# EasyEDA Pro project ProPrj_Hitboard Zero PCB_2026-02-22.epro

# Board PCB1
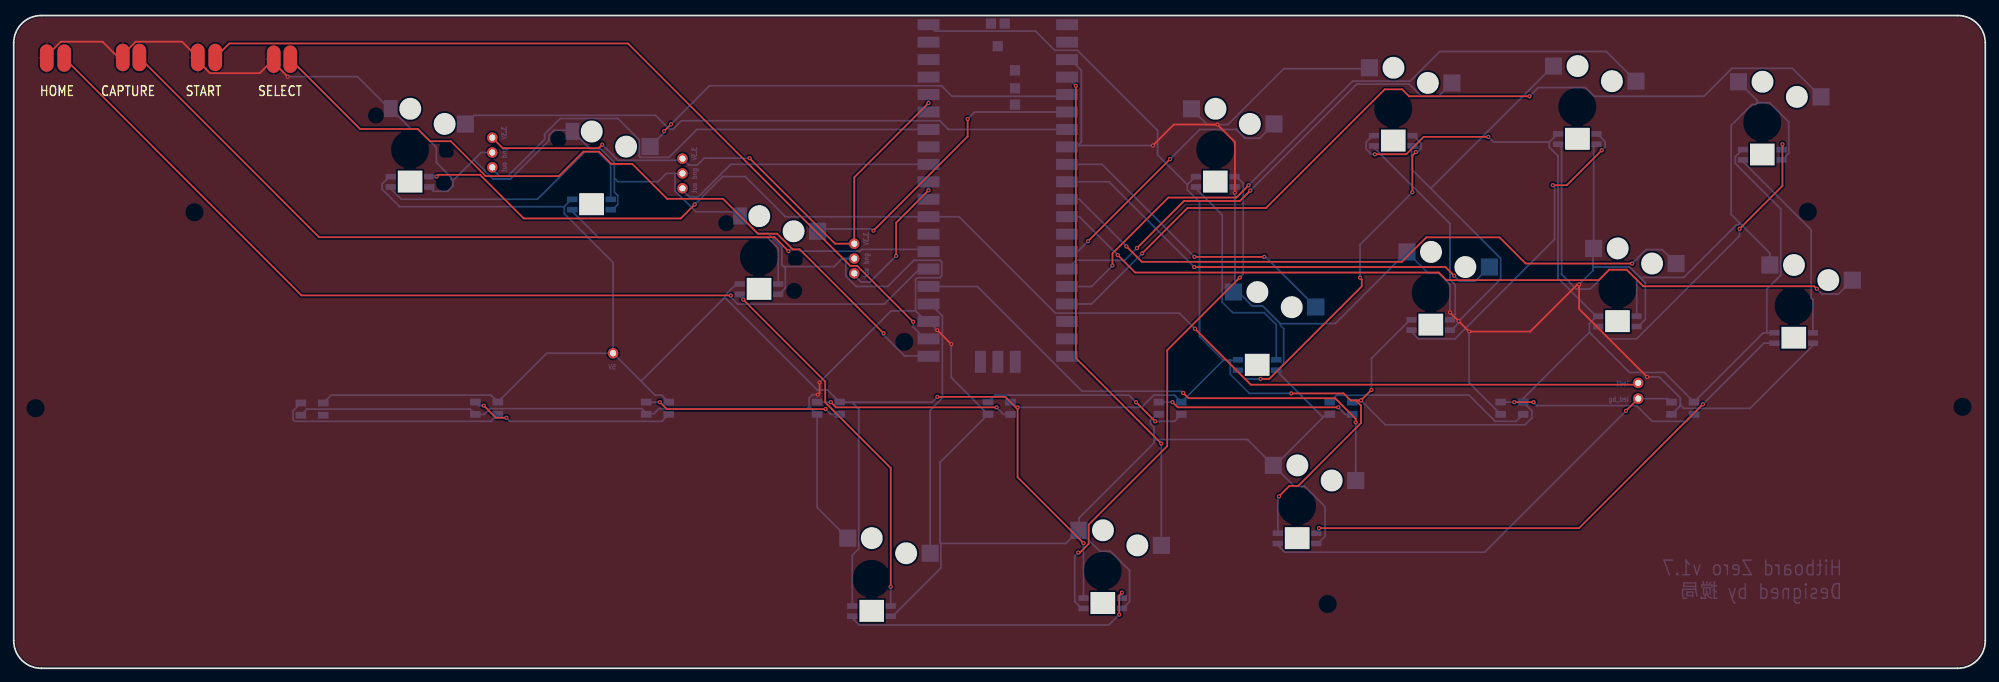
[diagram p0: board, top side]
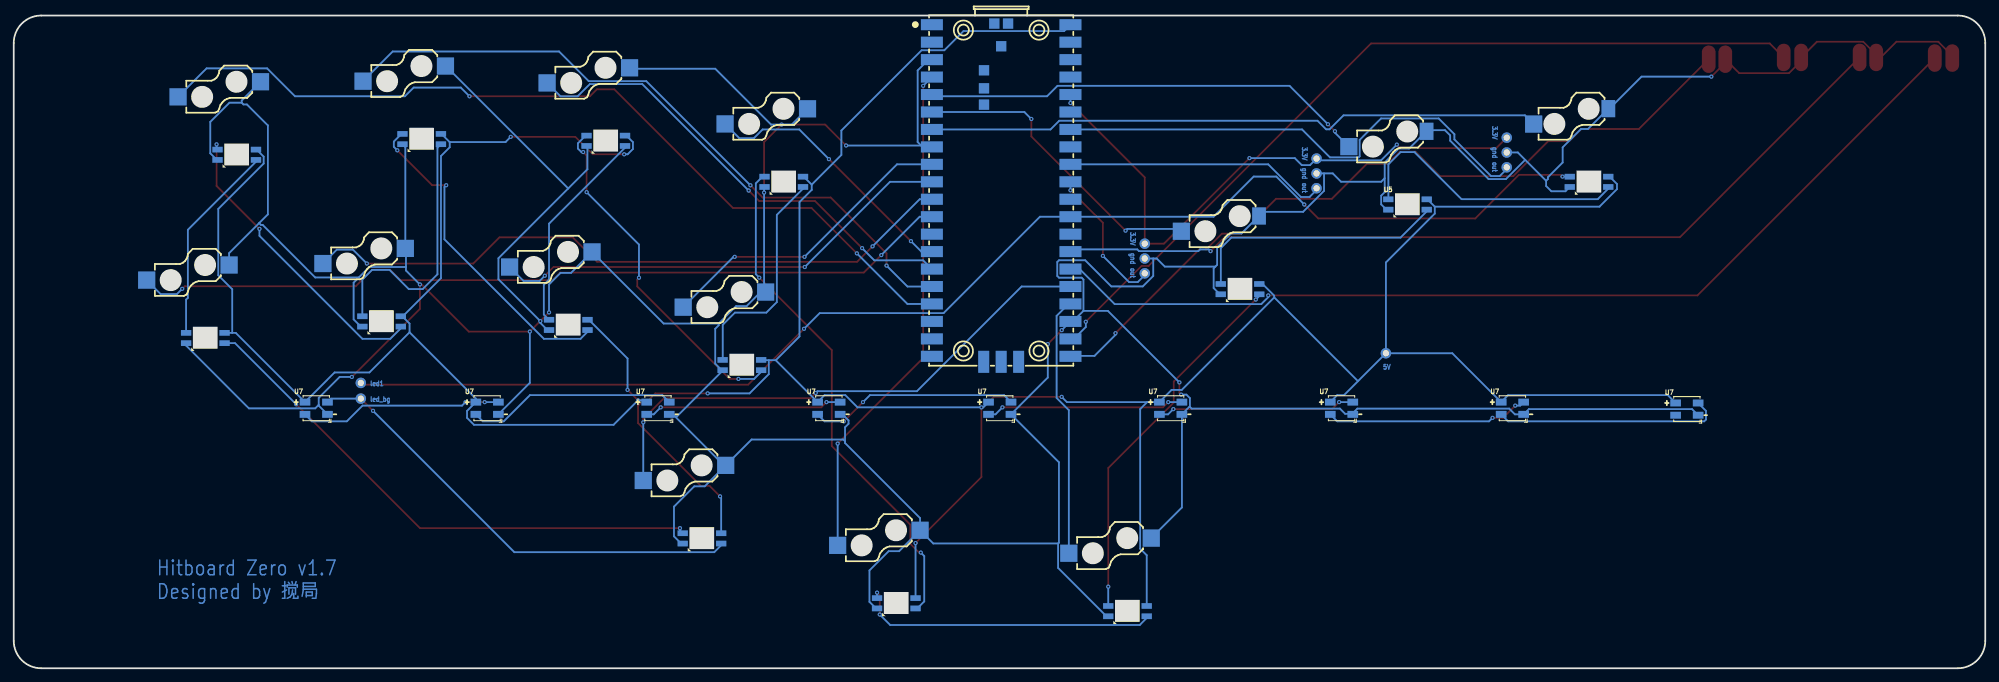
[diagram p1: board, bottom side, seen from below]

Outline 287 x 95 mm; copper layers: Top Layer, Bottom Layer. Coordinates in mm from the lower left corner of the outline.
Outline path: 0,91 arc(1.17,93.83) 4,95 283,95 arc(285.83,93.83) 287,91 287,4 arc(285.83,1.17) 283,0 4,0 arc(1.17,1.17) 0,4 0,91
Stack: Top Layer 0.035mm / Dielectric1 1.51mm FR4 er 4.5 / Bottom Layer 0.035mm

## Design rules (mm)
template: JLCPCB Capability(Two Layers Board)
spacing copperThickness1oz (default): track to track 0.102, other pairs 0.152 to 0.3
spacing copperThickness2oz: track to track 0.203, other pairs 0.152 to 0.3
track width copperThickness1oz (default): min 0.127, default 0.254, max 2.54
track width copperThickness2oz: min 0.203, default 0.254, max 2.54
differential pair differentialPair (default): width min 0.127, default 0.254, max 2.54; gap min 0.152, default 0.152
via viaSize (default): diameter min 0.5, default 0.61, max 10; hole min 0.3, default 0.305, max 6.3

## Placement (name value [footprint] x y rotation side)
NOREF  -  [Pad_e675]  4.81 88.81 0 top
NOREF#2  -  [Pad_e678]  18.29 88.9 0 top
NOREF#3  -  [Pad_e676]  7.35 88.81 0 top
NOREF#4  -  [Pad_e10672]  69.66 72.91 90 top
NOREF#5  -  [Pad_e680]  29.34 88.9 0 top
NOREF#6  -  [Pad_e677]  15.87 88.9 0 top
NOREF#7  -  [Pad_e10656]  122.35 61.8 90 top
NOREF#8  -  [Pad_e10666]  97.35 69.86 90 top
NOREF#9  -  [Pad_e5255]  236.47 39.24 0 top
NOREF#10  -  [Pad_e434]  236.47 41.53 0 top
NOREF#11  -  [Pad_e10670]  69.66 77.23 90 top
NOREF#12  -  [Pad_e10657]  122.35 59.64 90 top
NOREF#13  -  [Pad_e681]  37.85 88.65 0 top
NOREF#14  -  [Pad_e10658]  122.35 57.48 90 top
NOREF#15  -  [Pad_e10664]  97.35 74.18 90 top
NOREF#16  -  [Pad_e10671]  69.66 75.07 90 top
NOREF#17  -  [Pad_e682]  40.26 88.65 0 top
NOREF#18  -  [Pad_e679]  26.8 88.9 0 top
NOREF#19  -  [Pad_e10654]  87.25 45.85 0 top
NOREF#20  -  [Pad_e10665]  97.35 72.02 90 top
U1  PICO  [COMM-SMD_L51.0-W21.0-P2.54_SC0916]  143.26 69.22 270 bottom
U5  -  [LED-SMD_L3.2-W2.8_YO-WS2812B-3528]  186.82 18.9 180 bottom
U5#2  -  [LED-SMD_L3.2-W2.8_YO-WS2812B-3528]  57.69 70.8 180 bottom
U5#3  -  [LED-SMD_L3.2-W2.8_YO-WS2812B-3528]  84.1 67.5 180 bottom
U5#4  -  [LED-SMD_L3.2-W2.8_YO-WS2812B-3528]  108.49 55.18 180 bottom
U5#5  -  [LED-SMD_L3.2-W2.8_YO-WS2812B-3528]  124.87 8.31 180 bottom
U5#6  -  [LED-SMD_L3.2-W2.8_YO-WS2812B-3528]  158.52 9.46 180 bottom
U5#7  -  [LED-SMD_L3.2-W2.8_YO-WS2812B-3528]  174.91 70.8 180 bottom
U5#8  -  [LED-SMD_L3.2-W2.8_YO-WS2812B-3528]  181 44.13 180 bottom
U5#9  -  [LED-SMD_L3.2-W2.8_YO-WS2812B-3528]  200.81 76.77 180 bottom
U5#10  -  [LED-SMD_L3.2-W2.8_YO-WS2812B-3528]  206.28 49.97 180 bottom
U5#11  -  [LED-SMD_L3.2-W2.8_YO-WS2812B-3528]  227.61 77.02 180 bottom
U5#12  -  [LED-SMD_L3.2-W2.8_YO-WS2812B-3528]  233.45 50.48 180 bottom
U5#13  -  [LED-SMD_L3.2-W2.8_YO-WS2812B-3528]  254.54 74.74 180 bottom
U5#14  -  [LED-SMD_L3.2-W2.8_YO-WS2812B-3528]  259.11 48.07 180 bottom
U6  -  [CONN-SMD_HOTPLUGPAKAGE__C9900010116-1]  235.99 60 180 bottom
U6#2  -  [CONN-SMD_HOTPLUGPAKAGE__C9900010116-1]  189.36 28.43 180 bottom
U6#3  -  [CONN-SMD_HOTPLUGPAKAGE__C9900010116-1]  127.41 17.84 180 bottom
U6#4  -  [CONN-SMD_HOTPLUGPAKAGE__C9900010116-1]  161.06 18.98 180 bottom
U6#5  -  [CONN-SMD_HOTPLUGPAKAGE__C9900010116-1]  177.45 80.32 180 bottom
U6#6  -  [CONN-SMD_HOTPLUGPAKAGE__C9900010116-1]  183.54 53.65 180 bottom
U6#7  -  [CONN-SMD_HOTPLUGPAKAGE__C9900010116-1]  203.35 86.29 180 bottom
U6#8  -  [CONN-SMD_HOTPLUGPAKAGE__C9900010116-1]  208.82 59.5 180 bottom
U6#9  -  [CONN-SMD_HOTPLUGPAKAGE__C9900010116-1]  230.15 86.55 180 bottom
U6#10  -  [CONN-SMD_HOTPLUGPAKAGE__C9900010116-1]  257.08 84.26 180 bottom
U6#11  -  [CONN-SMD_HOTPLUGPAKAGE__C9900010116-1]  261.65 57.59 180 bottom
U6#12  -  [CONN-SMD_HOTPLUGPAKAGE__C9900010116-1#2]  60.23 80.32 180 bottom
U6#13  -  [CONN-SMD_HOTPLUGPAKAGE__C9900010116-1#3]  86.64 77.02 180 bottom
U6#14  -  [CONN-SMD_HOTPLUGPAKAGE__C9900010116-1#3]  111.03 64.7 180 bottom
U7  -  [LED-SMD_4P-L3.5-W3.5-TL_WS2812B]  43.43 37.72 180 bottom
U7#2  -  [LED-SMD_4P-L3.5-W3.5-TL_WS2812B]  242.97 37.85 180 bottom
U7#3  -  [LED-SMD_4P-L3.5-W3.5-TL_WS2812B]  218.09 37.85 180 bottom
U7#4  -  [LED-SMD_4P-L3.5-W3.5-TL_WS2812B]  193.21 37.85 180 bottom
U7#5  -  [LED-SMD_4P-L3.5-W3.5-TL_WS2812B]  168.34 37.85 180 bottom
U7#6  -  [LED-SMD_4P-L3.5-W3.5-TL_WS2812B]  143.46 37.85 180 bottom
U7#7  -  [LED-SMD_4P-L3.5-W3.5-TL_WS2812B]  118.59 37.85 180 bottom
U7#8  -  [LED-SMD_4P-L3.5-W3.5-TL_WS2812B]  93.71 37.85 180 bottom
U7#9  -  [LED-SMD_4P-L3.5-W3.5-TL_WS2812B]  68.83 37.85 180 bottom

## Footprints (pads in the part's own frame, mm; a bottom-side part is the same pattern mirrored in y, then rotated)
COMM-SMD_L51.0-W21.0-P2.54_SC0916
  rect 1.6x3.2 smd: 1(-24.445,-10.088) 2(-21.905,-10.088) 3(-19.365,-10.088) 4(-16.825,-10.088) 5(-14.285,-10.088) 6(-11.745,-10.088) 7(-9.205,-10.088) 8(-6.665,-10.088) 9(-4.125,-10.088) 10(-1.585,-10.088) 11(0.955,-10.088) 12(3.495,-10.088) 13(6.035,-10.088) 14(8.575,-10.088) 15(11.115,-10.088) 16(13.655,-10.088) 17(16.195,-10.088) 18(18.735,-10.088) 19(21.275,-10.088) 20(23.815,-10.088) 21(23.815,10.088) 22(21.275,10.088) 23(18.735,10.088) 24(16.195,10.088) 25(13.655,10.088) 26(11.115,10.088) 27(8.575,10.088) 28(6.035,10.088) 29(3.495,10.088) 30(0.955,10.088) 31(-1.585,10.088) 32(-4.125,10.088) 33(-6.665,10.088) 34(-9.205,10.088) 35(-11.745,10.088) 36(-14.285,10.088) 37(-16.825,10.088) 38(-19.365,10.088) 39(-21.905,10.088) 40(-24.445,10.088)
  rect 3.2x1.6 smd: 41(24.615,-2.54) 42(24.615,0) 43(24.615,2.54)
  rect 1.5x1.5 smd: TP1(-21.315,0) TP2(-24.615,1) TP3(-24.615,-1) TP4(-17.815,-2.5) TP5(-15.188,-2.5) TP6(-12.815,-2.5)
CONN-SMD_HOTPLUGPAKAGE__C9900010116-1
  rect 2.5x2.5 smd: 1(-6,-1.1) 2(6,1.1)
CONN-SMD_HOTPLUGPAKAGE__C9900010116-1#2
  rect 2.5x2.5 smd: 1(-5.515,-1.12)
  rect 2x2.5 smd: 2(5.36,1.125)
CONN-SMD_HOTPLUGPAKAGE__C9900010116-1#3
  rect 2.5x2.5 smd: 1(-6,-1.1)
  rect 2x2.5 smd: 2(5.31,1.125)
LED-SMD_4P-L3.5-W3.5-TL_WS2812B
  rect 1.545x0.997 smd: 1(-1.637,0.89) 2(-1.637,-0.89) 3(1.637,-0.89) 4(1.637,0.89)
LED-SMD_L3.2-W2.8_YO-WS2812B-3528
  rect 1.5x0.82 smd: 1(2.8,0.75) 2(2.8,-0.75) 3(-2.8,-0.75) 4(-2.8,0.75)
Pad_e434
  round 1.524 hole 0.914: 1(0,0)
Pad_e675
  oval 2x4 smd: 1(0,0)
Pad_e676
  oval 2x4 smd: 1(0,0)
Pad_e677
  oval 2x4 smd: 1(0,0)
Pad_e678
  oval 2x4 smd: 1(0,0)
Pad_e679
  oval 2x4 smd: 1(0,0)
Pad_e680
  oval 2x4 smd: 1(0,0)
Pad_e681
  oval 2x4 smd: 1(0,0)
Pad_e682
  oval 2x4 smd: 1(0,0)
Pad_e5255
  round 1.524 hole 0.914: 1(0,0)
Pad_e10654
  round 1.524 hole 0.914: 1(0,0)
Pad_e10656
  round 1.524 hole 0.914: 1(0,0)
Pad_e10657
  round 1.524 hole 0.914: 1(0,0)
Pad_e10658
  round 1.524 hole 0.914: 1(0,0)
Pad_e10664
  round 1.524 hole 0.914: 1(0,0)
Pad_e10665
  round 1.524 hole 0.914: 1(0,0)
Pad_e10666
  round 1.524 hole 0.914: 1(0,0)
Pad_e10670
  round 1.524 hole 0.914: 1(0,0)
Pad_e10671
  round 1.524 hole 0.914: 1(0,0)
Pad_e10672
  round 1.524 hole 0.914: 1(0,0)

## Nets
3V3: NOREF#7.1 NOREF#11.1 NOREF#15.1 U1.36
GND: NOREF.1 NOREF#6.1 NOREF#12.1 NOREF#13.1 NOREF#16.1 NOREF#18.1 NOREF#20.1 U1.3 U1.8 U1.23 U5.3 U5#2.3 U5#3.3 U5#4.3 U5#5.3 U5#6.3 U5#7.3 U5#8.3 U5#9.3 U5#10.3 U5#11.3 U5#12.3 U5#13.3 U5#14.3 U6.2 U6#2.2 U6#3.2 U6#4.2 U6#5.2 U6#6.2 U6#7.2 U6#8.2 U6#9.2 U6#10.2 U6#11.2 U6#12.2 U6#13.2 U6#14.2 U7.3 U7#2.3 U7#3.3 U7#4.3 U7#5.3 U7#6.3 U7#7.3 U7#8.3 U7#9.3
VCC: NOREF#19.1 U1.40 U5.1 U5#2.1 U5#3.1 U5#4.1 U5#5.1 U5#6.1 U5#7.1 U5#8.1 U5#9.1 U5#10.1 U5#11.1 U5#12.1 U5#13.1 U5#14.1 U7.1 U7#2.1 U7#3.1 U7#4.1 U7#5.1 U7#6.1 U7#7.1 U7#8.1 U7#9.1
2: U5#2.2 U5#3.4
3: U5#3.2 U5#4.4
4: U5#4.2 U5#5.4
5: U5#5.2 U5#6.4
6: U5#6.2 U5#7.4
7: U5#7.2 U5#8.4
8: U5#8.2 U5#9.4
9: U5#9.2 U5#10.4
10: U5#10.2 U5#11.4
11: U5#11.2 U5#12.4
12: U5#12.2 U5#13.4
13: U5#13.2 U5#14.4
14: U5.4 U5#14.2
15: NOREF#9.1 U5.2 U7#2.4
16: U7#2.2 U7#3.4
17: U7#3.2 U7#4.4
18: U7#4.2 U7#5.4
19: U7#5.2 U7#6.4
20: U7#6.2 U7#7.4
21: U7#7.2 U7#8.4
22: U7#8.2 U7#9.4
23: U7.4 U7#9.2
24: U7.2
A: U1.9 U6#6.1
B: U1.10 U6#8.1
CAPTURE: NOREF#2.1 U1.27
CIZHOU01: NOREF#4.1 U1.34
CIZHOU02: NOREF#8.1 U1.32
CIZHOU03: NOREF#14.1 U1.31
DOWN: U1.5 U6#13.1
HOME: NOREF#3.1 U1.26
L3: U1.24 U6#3.1
LB: U1.17 U6#10.1
LED1: NOREF#10.1 U1.29 U5#2.4
LEFT: U1.7 U6#12.1
LT: U1.12 U6#11.1
R3: U1.25 U6#2.1
RB: U1.16 U6#9.1
RIGHT: U1.6 U6#14.1
RT: U1.11 U6.1
SELECT: NOREF#17.1 U1.21
START: NOREF#5.1 U1.22
UP: U1.4 U6#4.1
X: U1.14 U6#5.1
Y: U1.15 U6#7.1

Pads without a net: U1 1 2 13 18 19 20 28 30 33 35 37 38 39 41 42 43 TP1 TP2 TP3 TP4 TP5 TP6

## Via types
v1: diameter 0.61, hole 0.305, Top Layer to Bottom Layer, 87 vias

## Routing (per net, layer and track width the routed paths; a pad name or vN(x,y) marks a point on that pad's centre or on a via; arc(x,y) is an arc through that point)
3V3: length 86.7
  Top Layer w0.254: v1(107.11,74.24) 119.56,61.8 NOREF#7.1 122.35,71.45 v1(133.17,82.26) ; NOREF#11.1 71.18,75.7 85.15,75.7 v1(85.66,76.21)
  Bottom Layer w0.254: v1(85.66,76.21) 87.95,73.92 97.09,73.92 NOREF#15.1 98.3,73.23 99.49,73.23 100.51,74.24 v1(107.11,74.24) ; v1(133.17,82.26) U1.36
GND: length 883.1
  Top Layer w0.254: NOREF.1 4.81,89.15 6.84,91.19 12.94,91.19 15.22,88.9 15.73,88.9 ; v1(177.77,69.22) 177.77,76.59 v1(175.23,79.13) 168.88,79.13 v1(165.83,76.08) ; v1(237.78,42.4) 227.87,52.3 v1(227.87,55.86) 227.62,55.86 220.76,49 v1(211.87,49) v1(210.35,50.53) v1(209.08,51.8) ; v1(117.31,41.6) 117.31,40.08 v1(117.06,39.82) ; 15.73,88.9 NOREF#6.1 ; 15.73,88.9 15.73,89.15 17.76,91.19 24.51,91.19 NOREF#18.1 26.8,88.39 28.57,86.61 35.81,86.61 NOREF#13.1 37.85,88.14 v1(39.88,86.11) ; v1(134.44,49.21) v1(136.47,47.18)
  Bottom Layer w0.254: 183.36,29.53 186.41,26.48 187.93,26.48 190.89,23.52 190.89,19.2 189.84,18.15 U5.3 ; 183.36,29.53 183.61,29.53 190.72,36.64 ; 183.36,29.53 179.59,33.29 166.24,33.29 165.99,33.04 ; U7#3.3 211.87,41.54 v1(211.87,49) ; 112.07,58.46 112.32,58.21 112.32,55.34 111.41,54.43 U5#4.3 ; 112.07,58.46 111.82,58.72 111.82,61.26 109.78,63.29 108.26,63.29 U6#14.2 105.12,66.43 99.3,66.43 96.25,69.48 96.25,72.02 ; 112.07,58.46 119.44,58.46 120.61,59.64 121.12,59.64 ; 255.65,58.69 255.65,60.42 251.28,64.79 ; 251.28,64.79 251.02,64.53 250.77,64.53 243.11,56.88 236.76,56.88 ; 251.28,64.79 250.01,66.06 250.01,79.01 253.05,82.06 253.56,82.06 253.82,82.31 ; 190.72,36.64 190.47,36.64 183.86,43.24 183.86,43.32 ; 190.72,36.64 191.04,36.96 U7#4.3 ; 121.12,59.64 121.12,57.1 122.64,55.57 127.22,55.57 131.03,59.38 134.84,59.38 135.09,59.13 135.09,57.1 134.84,56.84 131.53,56.84 131.28,56.59 131.28,52.02 ; 121.12,59.64 NOREF#12.1 ; 154.91,76.08 153.55,76.08 U1.8 ; 154.91,76.08 155.42,76.59 155.42,87 153.84,88.58 U1.3 ; 154.91,76.08 v1(165.83,76.08) ; 184.37,50.17 184.37,49.92 184.88,49.41 184.88,44.33 183.86,43.32 ; 184.37,50.17 192.39,50.17 U6#8.2 205.86,57.55 207.39,57.55 209.08,55.86 v1(209.08,51.8) ; 184.37,50.17 181.83,52.71 180.31,52.71 178.28,54.75 177.77,54.75 ; 87.43,71.32 87.94,70.81 93.78,70.81 94.98,72.02 96.25,72.02 ; 87.43,71.32 87.43,69.29 87.94,68.78 87.94,67.51 87.17,66.75 U5#3.3 ; 87.43,71.32 87.43,73.61 85.4,75.64 83.87,75.64 81.33,78.18 ; 253.82,82.31 253.82,82.62 251.08,85.36 ; 253.82,82.31 255.59,82.31 258.39,79.52 258.39,74.95 257.43,73.99 U5#13.3 ; 131.28,52.02 132.82,50.48 U1.23 v1(134.44,49.21) ; 131.28,52.02 127.72,52.02 v1(117.31,41.6) ; 236.76,56.88 235.24,58.4 229.9,58.4 ; 236.76,56.88 237.52,56.11 237.52,50.78 236.47,49.73 U5#12.3 ; 81.33,78.18 81.2,78.31 78.66,78.31 77.89,77.55 77.89,76.79 72.31,71.2 69.77,71.2 66.97,74 ; 81.33,78.18 U6#13.2 ; v1(117.06,39.82) 116.29,39.82 115.79,39.32 115.79,38.05 ; 134.97,18.16 153.14,18.16 U6#4.2 ; 134.97,18.16 134.97,14.6 127.93,7.56 U5#5.3 ; 134.97,18.16 134.85,18.28 134.85,29.98 U7#6.3 136.47,42.31 v1(136.47,47.18) ; U6#4.2 155.06,21.86 165.99,32.78 165.99,33.04 ; U6#4.2 158.11,17.04 159.64,17.04 162.43,14.24 162.43,9.67 161.47,8.71 U5#6.3 ; 206.28,69.83 224.1,87.65 U6#9.2 ; 206.28,69.83 216.44,59.67 216.44,56.62 v1(210.35,50.53) 210.35,50.27 209.45,49.37 209.23,49.37 U5#10.3 ; 206.28,69.83 203.49,72.62 203.49,75.89 U5#9.3 ; 165.99,33.04 165.99,35.07 165.48,35.58 165.48,36.09 166.24,36.85 166.59,36.85 U7#5.3 ; 66.97,74 68.04,75.07 NOREF#16.1 ; 66.97,74 63.92,70.95 ; 242.6,38.33 242.6,38.23 U7#2.3 ; 242.6,38.33 242.6,39.35 239.56,42.4 v1(237.78,42.4) ; 242.6,38.33 243.11,37.83 252.76,37.83 261.91,46.97 U5#14.3 ; U6#3.2 116.95,23.4 U7#7.3 115.86,38.05 115.79,38.05 ; 63.92,70.95 63.92,70.19 63.16,69.42 61.11,69.42 U5#2.3 ; 63.92,70.95 63.67,71.2 63.67,71.46 61.52,73.61 61.52,75.81 58.84,78.49 57.83,78.49 54.78,81.53 54.61,81.53 50.04,86.11 v1(39.88,86.11) ; U6#7.2 197.22,87.26 184.88,87.26 176.75,79.13 v1(175.23,79.13) 173.74,79.13 U6#5.2 ; 229.9,58.4 229.9,61.01 U6.2 229.99,75.85 U5#11.3 ; 229.9,58.4 229.9,57.89 v1(227.87,55.86) ; 96.25,72.02 NOREF#20.1 ; 177.77,54.75 U6#6.2 ; 177.77,54.75 v1(177.77,69.22) 177.77,69.99 U5#7.3 ; 183.86,43.32 U5#8.3 ; 115.79,38.05 115.53,37.79 93.94,37.79 93.18,37.03 92.16,37.03 ; 92.16,37.03 91.4,37.79 69.3,37.79 68.47,36.96 U7#9.3 66.43,37.72 42.69,37.72 U7.3 ; 92.16,37.03 U7#8.3
VCC: length 599.5
  Top Layer w0.254: v1(134.45,39.5) 144.35,39.5 145.88,37.97 v1(146.13,37.97) 146.13,27.81 v1(155.72,18.22) ; v1(184.18,25.02) 185.71,26.54 186.98,26.54 196.12,35.69 196.12,38.23 195.36,38.99 ; 195.36,38.99 194.61,38.99 193.6,40.01 v1(185.98,40.01) ; 195.36,38.99 v1(196.12,38.99) v1(197.65,40.51) ; v1(214.65,77.34) 205.25,77.34 202.71,74.8 v1(198.14,74.8)
  Bottom Layer w0.254: 170.84,70.39 172,71.55 U5#7.1 ; 170.84,70.39 166.52,74.71 166.52,78.26 154.83,89.95 151.53,89.95 148.74,92.74 134.09,92.74 U1.40 ; 170.84,70.39 170.84,69.63 172.61,67.85 172.61,48.29 176.07,44.83 ; 122,38.74 123.02,37.72 123.02,17.4 122.07,16.45 U5#5.1 ; 122,38.74 U7#7.1 118.45,40.51 116.97,40.51 103.51,53.98 ; 122,38.74 133.69,38.74 v1(134.45,39.5) ; U5#11.1 224.73,77.77 223.54,76.58 ; 176.07,44.83 177.09,44.83 ; 176.07,44.83 U7#5.1 168.96,39.75 165.94,39.75 164.17,37.97 v1(146.13,37.97) 145.86,37.97 U7#6.1 ; 177.09,44.83 177.09,42.8 179.88,40.01 v1(185.98,40.01) ; 177.09,44.83 178.16,44.83 U5#8.1 ; 223.54,76.58 223.54,75.82 224.81,74.55 224.81,56.77 230.4,51.18 ; 223.54,76.58 215.41,76.58 v1(214.65,77.34) ; v1(184.18,25.02) 184.02,24.85 184.02,19.65 ; 80.14,67.18 56.16,67.18 53.62,69.72 53.62,70.49 54.51,71.38 54.72,71.38 U5#2.1 ; 80.14,67.18 81.2,68.25 U5#3.1 ; 80.14,67.18 80.14,66.17 87.25,59.06 NOREF#19.1 ; v1(198.14,74.8) 197.63,74.8 196.87,75.57 196.87,76.58 197.8,77.52 U5#9.1 ; v1(155.72,18.22) U5#6.1 ; 255.19,48.82 255.19,55.17 257.22,57.2 257.22,66.85 250.62,73.45 250.62,74.47 251.64,75.49 U5#13.1 ; 255.19,48.82 U5#14.1 ; 255.19,48.82 254.68,48.82 U7#2.1 240.29,43.05 235.22,43.05 229.38,48.9 ; U7.1 46.21,39.75 69.46,39.75 U7#9.1 77.58,45.85 NOREF#19.1 ; 230.4,51.18 229.38,50.17 229.38,48.9 ; 230.4,51.18 U5#12.1 ; U7#4.1 195.11,38.99 v1(196.12,38.99) 199.68,35.43 220,35.43 221.01,36.45 221.01,37.45 U7#3.1 219.73,39.24 229.38,48.9 ; 103.51,53.98 91.31,41.78 ; 103.51,53.98 103.51,54.23 105.2,55.93 U5#4.1 ; 91.31,41.78 93.34,39.75 94.33,39.75 U7#8.1 ; 91.31,41.78 NOREF#19.1 ; v1(197.65,40.51) 197.65,45.09 203.12,50.56 203.31,50.56 U5#10.1
2: length 41.6
  Bottom Layer w0.254: U5#3.4 86.89,68.26 86.89,73.34 85.11,75.12 83.08,75.12 76.23,68.27 56.41,68.27 54.89,69.8 U5#2.2
3: length 37.7
  Bottom Layer w0.254: U5#3.2 81.3,66.49 85.11,62.68 109.75,62.68 111.29,61.15 U5#4.4
4: length 54.5
  Top Layer w0.254: v1(106.19,53.67) 118.13,41.73 118.13,38.68 127.67,29.14 v1(127.67,11.87)
  Bottom Layer w0.254: v1(127.67,11.87) U5#5.4 ; v1(106.19,53.67) 105.69,54.17 U5#4.2
5: length 44.3
  Top Layer w0.254: v1(161.32,11.01) 160.93,10.61 v1(160.93,7.82)
  Bottom Layer w0.254: U5#5.2 122.07,7.31 123.08,6.3 159.41,6.3 v1(160.93,7.82) ; v1(161.32,11.01) U5#6.4
6: length 74.5
  Top Layer w0.254: v1(178.47,56.85) 167.92,46.3 167.92,32.33 156.49,20.9 156.49,18.11 155.22,16.84 v1(154.96,16.84)
  Bottom Layer w0.254: U5#7.4 178,71.55 178.98,70.57 178.98,57.36 v1(178.47,56.85) ; U5#6.2 155.47,8.71 154.45,9.72 154.45,16.33 v1(154.96,16.84)
7: length 32.7
  Bottom Layer w0.254: U5#7.2 172.11,69.8 175.92,65.99 175.92,53.29 177.44,51.76 182.01,51.76 183.79,49.98 183.79,44.89 U5#8.4
8: length 50.8
  Top Layer w0.254: v1(203.6,69.29) 203.6,74.62 v1(204.11,75.13) ; v1(181.5,42.11) 182.77,42.11 196.24,55.57 196.24,56.59 v1(195.98,56.84)
  Bottom Layer w0.254: U5#9.4 203.84,77.3 203.97,77.3 204.87,76.4 204.87,75.64 204.36,75.13 v1(204.11,75.13) ; U5#8.2 178.2,43.13 179.22,42.11 v1(181.5,42.11) ; v1(203.6,69.29) 195.98,61.67 v1(195.98,56.84)
9: length 30.5
  Bottom Layer w0.254: U5#10.4 209.84,51.48 209.84,55.81 209.08,56.58 209.08,64.7 198.01,75.76 U5#9.2
10: length 47.9
  Top Layer w0.254: v1(224.05,70.3) 226.08,70.3 v1(231.16,75.38)
  Bottom Layer w0.254: U5#10.2 203.48,48.97 204.49,47.95 209.83,47.95 224.3,62.43 224.3,70.05 v1(224.05,70.3) ; U5#11.4 230.55,77.77 231.67,76.65 231.67,75.89 v1(231.16,75.38)
11: length 38
  Bottom Layer w0.254: U5#11.2 225.32,75.76 225.32,57.34 227.47,55.19 229.5,55.19 232.29,57.98 234.83,57.98 236.25,56.56 U5#12.4
12: length 44.4
  Top Layer w0.254: v1(257.47,76.25) 257.47,70.2 v1(251.23,63.95)
  Bottom Layer w0.254: v1(251.23,63.95) 251.23,62.94 236.24,47.95 232.18,47.95 230.65,49.48 U5#12.2 ; v1(257.47,76.25) 257.47,75.63 U5#13.4
13: length 29.4
  Bottom Layer w0.254: U5#13.2 251.74,73.73 261.65,63.81 261.65,53.91 261.91,53.65 U5#14.4
14: length 78.4
  Top Layer w0.254: v1(190.01,20.39) 227.86,20.39 v1(245.89,38.43)
  Bottom Layer w0.254: v1(190.01,20.39) 190.01,20.05 U5.4 ; v1(245.89,38.43) 254.78,47.32 U5#14.2
15: length 67.5
  Top Layer w0.254: NOREF#9.1 v1(234.7,37.47)
  Bottom Layer w0.254: v1(234.7,37.47) 214.12,16.89 185.02,16.89 184.02,17.9 184.02,18.15 ; U7#2.4 240.82,39.24 NOREF#9.1
16: length 29.7
  Top Layer w0.254: v1(221.24,38.73) v1(218.44,38.73)
  Bottom Layer w0.254: v1(218.44,38.73) 216.45,38.73 ; v1(221.24,38.73) 221.74,38.23 236.22,38.23 238.51,35.94 243.59,35.94 U7#2.2
17: length 30.6
  Bottom Layer w0.254: U7#3.2 218.71,35.94 215.66,35.94 211.85,39.75 192.59,39.75 U7#4.4
18: length 28.9
  Top Layer w0.254: v1(168.69,38.73) 169.45,37.97 v1(192.82,37.97)
  Bottom Layer w0.254: v1(168.69,38.73) 166.7,38.73 ; U7#4.2 193.84,36.96 v1(192.82,37.97)
19: length 30.6
  Top Layer w0.254: v1(166.17,35.94) v1(163.37,38.73)
  Bottom Layer w0.254: U7#5.2 168.96,35.94 v1(166.17,35.94) ; U7#6.4 142.84,39.75 162.36,39.75 v1(163.37,38.73)
20: length 28.9
  Top Layer w0.254: v1(143.07,37.97) 119.7,37.97 v1(118.94,38.73)
  Bottom Layer w0.254: v1(118.94,38.73) 116.95,38.73 ; U7#6.2 144.08,36.96 v1(143.07,37.97)
21: length 28.9
  Top Layer w0.254: v1(118.19,37.72) 95.08,37.72 v1(94.06,38.73)
  Bottom Layer w0.254: v1(118.19,37.72) 118.95,36.96 U7#7.2 ; v1(94.06,38.73) 92.07,38.73
22: length 29.7
  Top Layer w0.254: v1(71.73,36.45) 70.2,36.45 v1(68.42,38.23)
  Bottom Layer w0.254: U7#8.2 94.33,35.94 72.23,35.94 v1(71.73,36.45) ; U7#9.4 67.71,38.23 v1(68.42,38.23)
23: length 33.2
  Bottom Layer w0.254: U7#9.2 69.46,35.94 40.91,35.94 40.66,36.19 40.66,37.47 U7.4
A: length 44.8
  Top Layer w0.254: v1(171.89,59.88) v1(182.05,59.88)
  Bottom Layer w0.254: v1(171.89,59.88) 158.42,73.34 U1.9 ; U6#6.1 182.22,59.88 v1(182.05,59.88)
B: length 68.3
  Top Layer w0.254: v1(171.84,58.4) 208.42,58.4 v1(209.69,57.13)
  Bottom Layer w0.254: v1(171.84,58.4) 159.44,70.8 U1.10 ; v1(209.69,57.13) 210.45,56.36 212.78,56.36 U6#8.1
CAPTURE: length 127
  Top Layer w0.254: v1(112.78,60.71) 110.74,62.74 44.45,62.74 NOREF#2.1
  Bottom Layer w0.254: U1.27 132.85,60.96 123.44,60.96 123.19,60.71 114.55,60.71 114.3,60.96 113.03,60.96 v1(112.78,60.71)
CIZHOU01: length 73.5
  Bottom Layer w0.254: NOREF#4.1 69.66,72.65 70.68,71.64 71.95,71.64 77.28,76.97 77.28,77.73 79.57,80.02 87.95,80.02 91.07,76.9 91.07,74.5 91.22,74.36 95.39,74.36 99.45,78.42 U1.34
CIZHOU02: length 38.5
  Bottom Layer w0.254: NOREF#8.1 97.35,69.61 98.36,68.59 99.63,68.59 104.38,73.34 U1.32
CIZHOU03: length 21.1
  Top Layer w0.254: v1(128.45,60.02) 128.45,64.84 v1(133.17,69.56)
  Bottom Layer w0.254: v1(133.17,69.56) U1.31 ; v1(128.45,60.02) 124.64,56.21 123.37,56.21 122.35,57.22 NOREF#14.1
DOWN: length 65.2
  Top Layer w0.254: v1(95.69,79.18) v1(94.67,78.17)
  Bottom Layer w0.254: U1.5 153.09,83.25 136.58,83.25 135.06,84.77 101.27,84.77 v1(95.69,79.18) ; v1(94.67,78.17) 94.67,77.95 U6#13.1
HOME: length 143.1
  Top Layer w0.254: v1(104.38,54.26) 41.89,54.26 NOREF#3.1
  Bottom Layer w0.254: U1.26 132.94,58.33 132.06,58.33 126.73,52.99 105.39,52.99 104.38,54.01 v1(104.38,54.26)
L3: length 38
  Bottom Layer w0.254: U6#3.1 133.41,37.57 135.19,39.35 135.19,51.28 133.45,53.02 U1.24
LB: length 127.5
  Top Layer w0.254: v1(220.65,83.25) 203.13,83.25 202.11,84.26 199.57,84.26 182.3,66.99 170.87,66.99 v1(164.27,60.39)
  Bottom Layer w0.254: U6#10.1 258.93,87.31 250.12,87.31 246.05,83.25 230.05,83.25 228.78,84.52 221.92,84.52 v1(220.65,83.25) ; v1(164.27,60.39) 156.9,53.02 U1.17
LED1: length 193.9
  Top Layer w0.254: NOREF#10.1 236.22,41.28 180.09,41.28 v1(171.96,49.4) ; v1(99.13,67.5) 97.1,65.47 74.24,65.47 67.89,71.82 61.79,71.82 v1(61.54,71.56)
  Bottom Layer w0.254: U5#2.4 60.5,71.56 v1(61.54,71.56) ; v1(171.96,49.4) 169.67,51.69 151.64,51.69 137.61,65.72 U1.29 112.34,65.72 106.5,71.56 103.2,71.56 v1(99.13,67.5)
LEFT: length 90
  Bottom Layer w0.254: U6#12.1 67.01,80.47 93.42,80.47 95.45,78.44 95.96,78.44 97.21,79.69 134.8,79.69 136.07,78.42 U1.7
LT: length 121.1
  Top Layer w0.254: v1(160.71,60.13) 163.25,57.59 207.45,57.59 208.55,56.49 230.73,56.49 232.25,58.02 234.79,58.02 237.21,55.59 262.11,55.59 v1(262.48,55.22)
  Bottom Layer w0.254: U1.12 155.12,65.72 v1(160.71,60.13) ; U6#11.1 265.62,54.46 263.24,54.46 v1(262.48,55.22)
R3: length 79.1
  Top Layer w0.254: v1(170.25,40.07) 171.01,39.3 192.35,39.3 195.36,36.3 v1(195.36,35.79)
  Bottom Layer w0.254: v1(170.25,40.07) 170,40.32 155.52,40.32 140.28,55.56 U1.25 ; v1(195.36,35.79) U6#2.1
RB: length 99.8
  Top Layer w0.254: v1(159.95,58.61) 159.95,60.39 168.08,68.51 177.98,68.51 v1(179.76,70.29)
  Bottom Layer w0.254: v1(159.95,58.61) 156.9,55.56 U1.16 ; v1(179.76,70.29) 194.91,85.45 203.3,85.45 207.61,89.77 231.83,89.77 U6#9.1
RIGHT: length 45.2
  Top Layer w0.254: v1(125.15,63.69) 138.87,77.4 v1(138.87,79.94)
  Bottom Layer w0.254: v1(138.87,79.94) 139.88,80.96 U1.6 ; U6#14.1 117.37,63.94 124.9,63.94 v1(125.15,63.69)
RT: length 97.2
  Top Layer w0.254: v1(161.98,61.4) 164.22,59.16 202.07,59.16 205.63,62.71 216.29,62.71 220.1,58.9 v1(235.6,58.9)
  Bottom Layer w0.254: U6.1 239.96,60.94 237.63,60.94 v1(235.6,58.9) ; v1(161.98,61.4) 155.12,68.26 U1.11
SELECT: length 113.9
  Top Layer w0.254: v1(126.62,48.77) 114.43,60.96 113.41,60.96 111.12,63.25 108.33,63.25 103.25,68.33 95.12,68.33 90.04,73.41 87,73.41 85.22,75.18 82.93,75.18 79.38,71.63 68.71,71.63 63.63,76.71 60.58,76.71 58.8,78.49 50.42,78.49 NOREF#17.1
  Bottom Layer w0.254: U1.21 133.1,45.47 129.67,45.47 126.62,48.51 v1(126.62,48.77)
START: length 122.9
  Top Layer w0.254: v1(130.94,50.43) 122.81,58.55 121.79,58.55 89.42,90.93 31.37,90.93 NOREF#5.1
  Bottom Layer w0.254: U1.22 132.97,48.14 132.46,48.14 130.94,49.66 v1(130.94,50.43)
UP: length 73.8
  Top Layer w0.254: v1(167.06,32.7) 154.61,45.15 v1(154.61,84.77)
  Bottom Layer w0.254: v1(167.06,32.7) 167.06,17.89 ; U1.4 v1(154.61,84.77)
X: length 38.9
  Top Layer w0.254: v1(156.39,62.16) v1(168.33,74.1)
  Bottom Layer w0.254: U6#5.1 181.37,77.15 179.25,77.15 177.98,78.42 172.65,78.42 v1(168.33,74.1) ; v1(156.39,62.16) 154.87,60.64 U1.14
Y: length 68.7
  Top Layer w0.254: v1(163.5,61.15) 170.36,68.01 178.49,68.01 v1(180.01,69.53)
  Bottom Layer w0.254: U1.15 154.61,59.37 161.73,59.37 v1(163.5,61.15) ; U6#7.1 207.41,83.25 204.91,83.25 203.13,85.02 195.51,85.02 v1(180.01,69.53)

## Copper pours and planes (outline as drawn; the poured copper is in the pictures)
GND on Top Layer: -8.51,99.57 305.44,99.57 305.44,-6.86 -8.51,-6.86

## Text on the board
Bottom Layer: 5V | led1 | led_bg | out | 3.3V | gnd | Hitboard Zero v1.7 / Designed by 搅局
Top Silkscreen Layer: HOME | CAPTURE | START | SELECT
